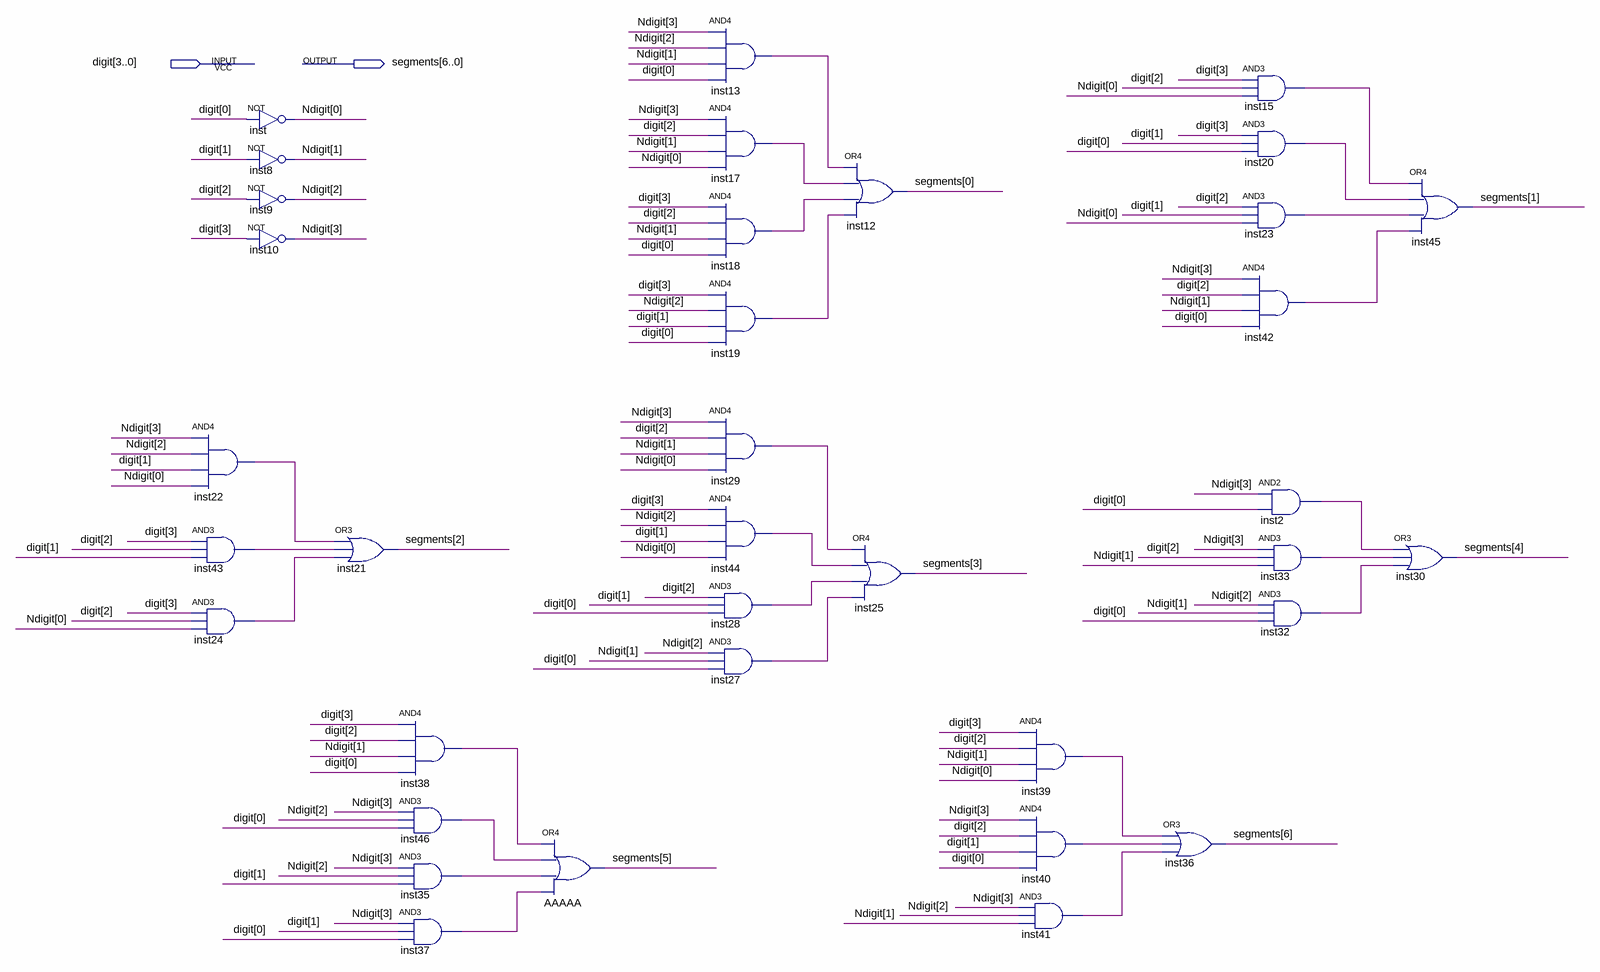
[diagram p0: schematic sheet]
// Quartus schematic SevenSegmentDisplay.bdf as structural Verilog: 36 symbols, 2 pins
module SevenSegmentDisplay (
  input  [3:0] digit,
  output [6:0] segments
);

  wire inst2_out, inst13_out, inst15_out, inst17_out, inst18_out, inst19_out, inst20_out, inst22_out,
       inst23_out, inst24_out, inst27_out, inst28_out, inst29_out, inst32_out, inst33_out, inst35_out,
       inst37_out, inst38_out, inst39_out, inst40_out, inst41_out, inst42_out, inst43_out, inst44_out,
       inst46_out;
  wire [3:0] Ndigit;

  and inst22 (inst22_out, Ndigit[3], Ndigit[2], digit[1], Ndigit[0]);
  and inst43 (inst43_out, digit[3], digit[2], digit[1]);
  and inst24 (inst24_out, digit[3], digit[2], Ndigit[0]);
  not inst (Ndigit[0], digit[0]);
  not inst8 (Ndigit[1], digit[1]);
  not inst9 (Ndigit[2], digit[2]);
  not inst10 (Ndigit[3], digit[3]);
  or inst21 (segments[2], inst22_out, inst43_out, inst24_out);
  and inst38 (inst38_out, digit[3], digit[2], Ndigit[1], digit[0]);
  and inst46 (inst46_out, Ndigit[3], Ndigit[2], digit[0]);
  and inst35 (inst35_out, Ndigit[3], Ndigit[2], digit[1]);
  and inst37 (inst37_out, Ndigit[3], digit[1], digit[0]);
  or AAAAA (segments[5], inst38_out, inst46_out, inst35_out, inst37_out);
  and inst13 (inst13_out, Ndigit[3], Ndigit[2], Ndigit[1], digit[0]);
  and inst17 (inst17_out, Ndigit[3], digit[2], Ndigit[1], Ndigit[0]);
  and inst18 (inst18_out, digit[3], digit[2], Ndigit[1], digit[0]);
  and inst19 (inst19_out, digit[3], Ndigit[2], digit[1], digit[0]);
  and inst29 (inst29_out, Ndigit[3], digit[2], Ndigit[1], Ndigit[0]);
  and inst44 (inst44_out, digit[3], Ndigit[2], digit[1], Ndigit[0]);
  and inst28 (inst28_out, digit[2], digit[1], digit[0]);
  and inst27 (inst27_out, Ndigit[2], Ndigit[1], digit[0]);
  or inst12 (segments[0], inst13_out, inst17_out, inst18_out, inst19_out);
  or inst25 (segments[3], inst29_out, inst44_out, inst28_out, inst27_out);
  and inst39 (inst39_out, digit[3], digit[2], Ndigit[1], Ndigit[0]);
  and inst40 (inst40_out, Ndigit[3], digit[2], digit[1], digit[0]);
  and inst41 (inst41_out, Ndigit[3], Ndigit[2], Ndigit[1]);
  or inst36 (segments[6], inst39_out, inst40_out, inst41_out);
  and inst15 (inst15_out, digit[3], digit[2], Ndigit[0]);
  and inst20 (inst20_out, digit[3], digit[1], digit[0]);
  and inst23 (inst23_out, digit[2], digit[1], Ndigit[0]);
  and inst42 (inst42_out, Ndigit[3], digit[2], Ndigit[1], digit[0]);
  and inst2 (inst2_out, Ndigit[3], digit[0]);
  and inst33 (inst33_out, Ndigit[3], digit[2], Ndigit[1]);
  and inst32 (inst32_out, Ndigit[2], Ndigit[1], digit[0]);
  or inst45 (segments[1], inst15_out, inst20_out, inst23_out, inst42_out);
  or inst30 (segments[4], inst2_out, inst33_out, inst32_out);
endmodule
